# EAGLE design trans (EAGLE 8.7.0)
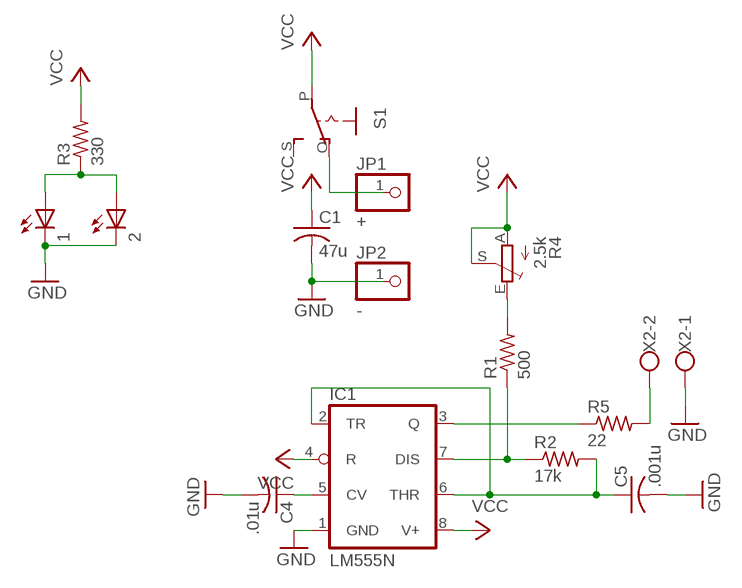
[diagram p0: schematic, sheet 1]

## Parts
1  LED3MM  [LED3MM]
2  LED3MM  [LED3MM]
C1  47u  C-US050-025X075  [C050-025X075]
C4  .01u  C-US025-025X050  [C025-025X050]
C5  .001u  C-US025-025X050  [C025-025X050]
IC1  LM555N  [DIL08]
JP1  +  PINHD-1X1  [1X01]
JP2  -  PINHD-1X1  [1X01]
R1  500  R-US_0207/10  [0207/10]
R2  17k  R-US_0207/10  [0207/10]
R3  330  R-US_0207/10  [0207/10]
R4  2.5k  TRIM_EU-CA9V  [CA9V]
R5  22  R-US_0207/10  [0207/10]
S1  EG1218S  [EG1218]
X2  W237-102  [W237-102]

## Nets
GND: 1.K(C) 2.K(C) C1.2 C4.2 C5.2 IC1.1(GND) JP2.1 X2.1
N$1: 1.A 2.A R3.1
N$2: C4.1 IC1.5(CV)
N$3: C5.1 IC1.2(TR) IC1.6(THR) R2.2
N$4: IC1.7(DIS) R1.1 R2.1
N$5: R1.2 R4.E
N$6: IC1.3(Q) R5.1
N$7: JP1.1 S1.O
N$8: R5.2 X2.2
VCC: C1.1 IC1.4(R) IC1.8(V+) R3.2 R4.A R4.S S1.P
Unconnected: S1.S

## Library data of the parts
1 2 = led:LED: LED OSRAM: - CHIPLED LG R971, LG N971, LY N971, LG Q971, LY Q971, LO R971, LY R971 LH N974, LH R974 LS Q976, LO Q976, LY Q976 LO Q996 - Hyper CHIPLED LW Q18S LB Q993, LB Q99A, LB R99A - SideLED LS A670, LO A670, LY A670, LG A670, LP A670 LB A673, LV A673, LT A673, LW A673 LH A674 LY A675 LS A676, LA A676, LO A676, LY A676, LW A676 LS A679, LY A679, LG A679 - Hyper Micro SIDELED® LS Y876, LA Y876, LO Y876, LY Y876 LT Y87S - SmartLED LW L88C, LW L88S LB L89C, LB L89S, LG L890 LS L89K, LO L89K, LY L89K LS L896, LA L896, LO L896, LY L896 - TOPLED LS T670, LO T670, LY T670, LG T670, LP T670 LSG T670, LSP T670, LSY T670, LOP T670, LYG T670 LG T671, LOG T671, LSG T671 LB T673, LV T673, LT T673, LW T673 LH T674 LS T676, LA T676, LO T676, LY T676, LB T676, LH T676, LSB T676, LW T676 LB T67C, LV T67C, LT T67C, LS T67K, LO T67K, LY T67K, LW E67C LS E67B, LA E67B, LO E67B, LY E67B, LB E67C, LV E67C, LT E67C LW T67C LS T679, LY T679, LG T679 LS T770, LO T770, LY T770, LG T770, LP T770 LB T773, LV T773, LT T773, LW T773 LH T774 LS E675, LA E675, LY E675, LS T675 LS T776, LA T776, LO T776, LY T776, LB T776 LHGB T686 LT T68C, LB T68C - Hyper Mini TOPLED® LB M676 - Mini TOPLED Santana® LG M470 LS M47K, LO M47K, LY M47K Source: http://www.osram.convergy.de LUXEON: - LUMILED® LXK2-PW12-R00, LXK2-PW12-S00, LXK2-PW14-U00, LXK2-PW14-V00 LXK2-PM12-R00, LXK2-PM12-S00, LXK2-PM14-U00 LXK2-PE12-Q00, LXK2-PE12-R00, LXK2-PE12-S00, LXK2-PE14-T00, LXK2-PE14-U00 LXK2-PB12-K00, LXK2-PB12-L00, LXK2-PB12-M00, LXK2-PB14-N00, LXK2-PB14-P00, LXK2-PB14-Q00 LXK2-PR12-L00, LXK2-PR12-M00, LXK2-PR14-Q00, LXK2-PR14-R00 LXK2-PD12-Q00, LXK2-PD12-R00, LXK2-PD12-S00 LXK2-PH12-R00, LXK2-PH12-S00 LXK2-PL12-P00, LXK2-PL12-Q00, LXK2-PL12-R00 Source: www.luxeon.com KINGBRIGHT: KA-3528ASYC Source: www.kingbright.com
C1 C4 C5 = rcl:C-US: CAPACITOR, American symbol; SPICEPREFIX: C
IC1 = linear:*555: TIMER
JP1 JP2 = pinhead:PINHD-1X1: PIN HEADER
R1-R3 = rcl:R-US_: RESISTOR, American symbol
R4 = pot:TRIM_EU-: POTENTIOMETER
R5 = rcl:R-US_: RESISTOR, American symbol; SPICEPREFIX: R
S1 = adafruit:EG1218: SLIDING SWITCH 0.1" spacing through hole, vertical SPDT slide switch http://www.ladyada.net/library/pcb/eaglelibrary.html
X2 = con-wago-500:W237-102: WAGO SCREW CLAMP; MPN: 237-102; OC_FARNELL: unknown; OC_NEWARK: 70K9898

## Board
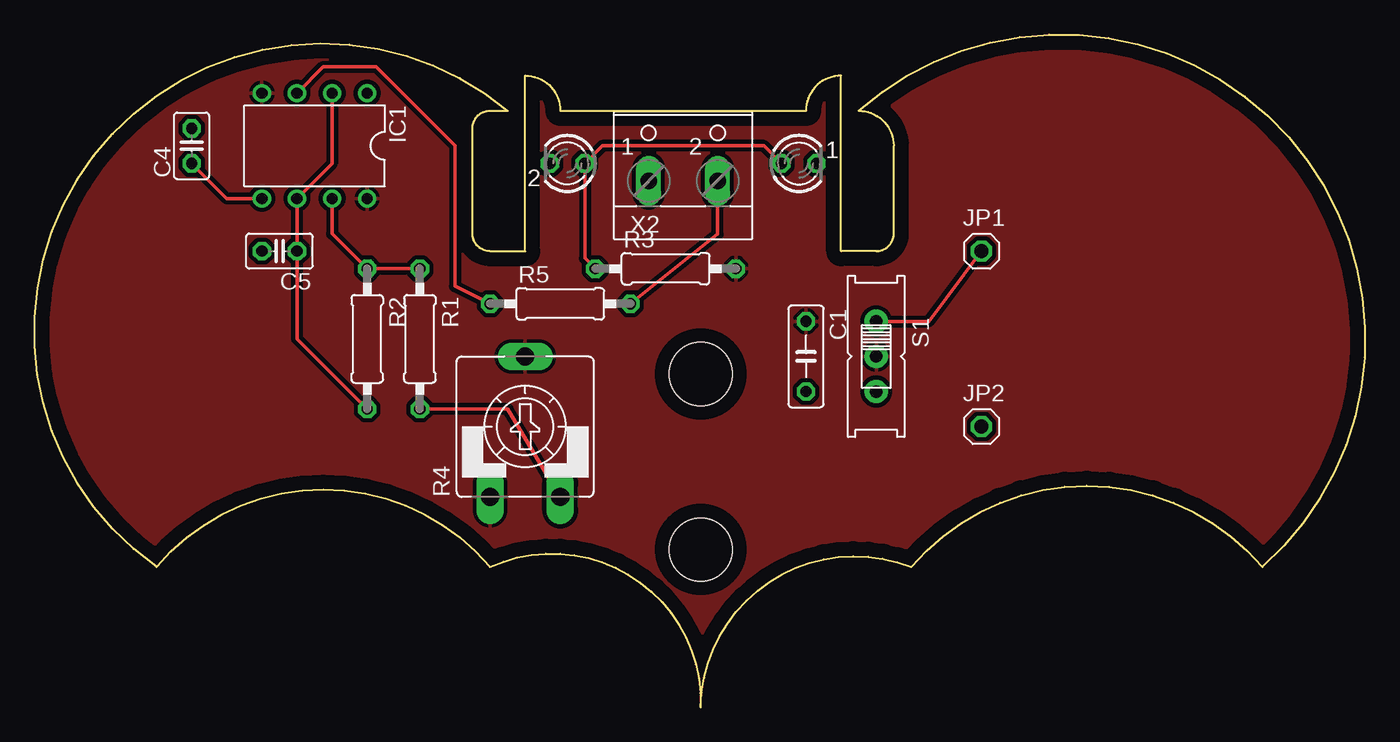
[diagram p1: board, top side]
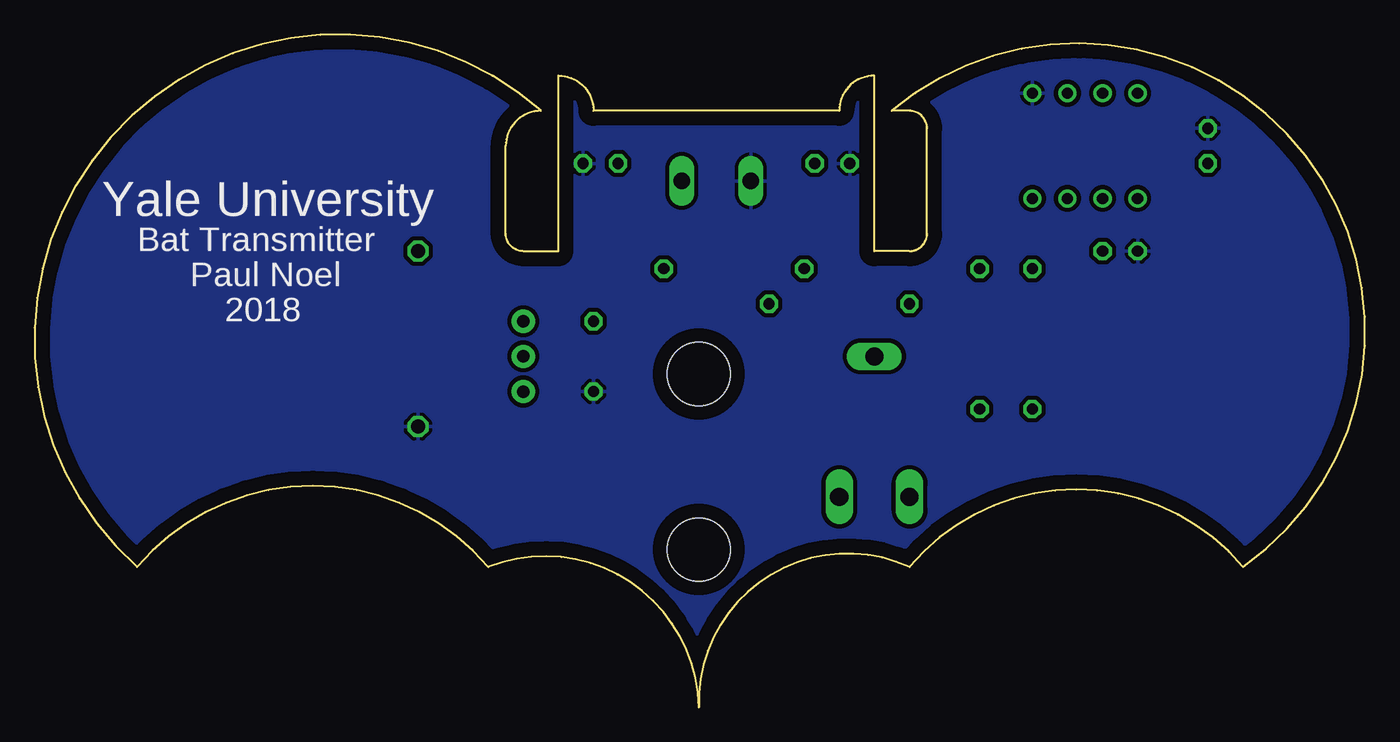
[diagram p2: board, bottom side, seen from below]

Size 96.26 x 48.7 mm. Coordinates in mm from the lower left corner, seen from the top.
Outline: 32.96,10.16 arc-117 48.2,0 arc-111 63.44,10.16 arc-99 88.84,10.16 arc180 59.63,43.18 arc-90 62.17,40.64 62.17,34.29 arc-90 60.9,33.02 58.36,33.02 58.36,45.72 arc90 55.82,43.18 38.04,43.18 arc90 35.5,45.72 35.5,33.02 32.96,33.02 arc-90 31.69,34.29 31.69,41.91 arc-90 32.96,43.18 34.23,43.18 arc185 8.83,10.16 arc-100 32.96,10.16
Copper layers (1*16): Top 0.035mm / dielectric 1.5mm / Bottom 0.035mm
Design rules "default": minimum track width 6mil, minimum drill 0.35mm, track to track 6mil, track to pad 6mil, pad to pad 6mil, via to via 6mil, smd to smd 6mil, copper to edge 40mil, drill to drill 6mil, minimum pad ring 10mil, minimum via ring 8mil, stop-mask expansion 4mil, vias tented up to drill 0mil, thermal gap 10mil
Holes 4.57 mm at 48.2,11.43 48.2,24.13

### Footprints (pad centres in the part's own frame; a part is rotated, then mirrored left to right if it is on the bottom)
LED3MM = drill 0.813 octagon: A -1.27,0; K 1.27,0
C050-025X075 = drill 0.813 octagon: 1 -2.54,0; 2 2.54,0
C025-025X050 = drill 0.813 octagon: 1 -1.27,0; 2 1.27,0
DIL08 = drill 0.813 pad 1.27: 1 -3.81,-3.81; 2 -1.27,-3.81; 3 1.27,-3.81; 4 3.81,-3.81; 5 3.81,3.81; 6 1.27,3.81; 7 -1.27,3.81; 8 -3.81,3.81
1X01 = drill 1.016 octagon: 1 0,0
0207/10 = drill 0.813 octagon: 1 -5.08,0; 2 5.08,0
CA9V = drill 1.321 long: A -2.54,-5.08; E 2.54,-5.08; S 0,5.08
EG1218 = drill 0.9 pad 1.676: O -2.54,0; P 0,0; S 2.54,0
W237-102 = drill 1.194 long: 1 -2.5,-1.27; 2 2.5,-1.27

### Placement (x,y rotation side)
1  55.31,39.37 0 top
2  38.55,39.37 180 top
C1  55.82,25.4 270 top
C4  11.37,40.64 90 top
C5  17.72,33.02 180 top
IC1  20.26,40.64 180 top
JP1  68.52,33.02 0 top
JP2  68.52,20.32 0 top
R1  27.88,26.67 270 top
R2  24.07,26.67 270 top
R3  45.66,31.75 0 top
R4  35.5,20.32 0 top
R5  38.04,29.21 0 top
S1  60.9,25.4 270 top
X2  46.93,39.37 0 top

### Tracks (layer width: path | path; a pad name or v marks a point on that pad's centre or on a via)
GND
  pour Bottom (isolate 0.305): -1.33,54.61 -1.33,-10.16 -0.06,-10.16 106.62,-10.16 106.62,-8.89 106.62,54.61
N$1
  Top 0.254: 1.A 52.77,40.64 41.09,40.64 2.A 39.82,32.51 R3.1
N$2
  Top 0.254: IC1.5 13.91,36.83 C4.1
N$3
  Top 0.254: R2.2 18.99,26.67 C5.1 IC1.6 21.53,39.37 IC1.2
N$4
  Top 0.254: IC1.7 21.53,34.29 R2.1 R1.1
N$5
  Top 0.254: R4.E 34.23,21.59 R1.2
N$6
  Top 0.254: R5.1 30.42,30.48 30.42,40.64 24.7,46.35 20.89,46.35 IC1.3
N$7
  Top 0.254: S1.O 64.71,27.94 JP1.1
N$8
  Top 0.254: R5.2 49.43,34.25 X2.2
VCC
  pour Top (isolate 0.305): -6.41,55.88 -6.41,-12.7 106.62,-12.7 106.62,-10.16 106.62,55.88 104.08,55.88

### Text on the board
bPlace: Yale University | Bat Transmitter | Paul Noel | 2018